# EAGLE schematic main (EAGLE 8.3.2)
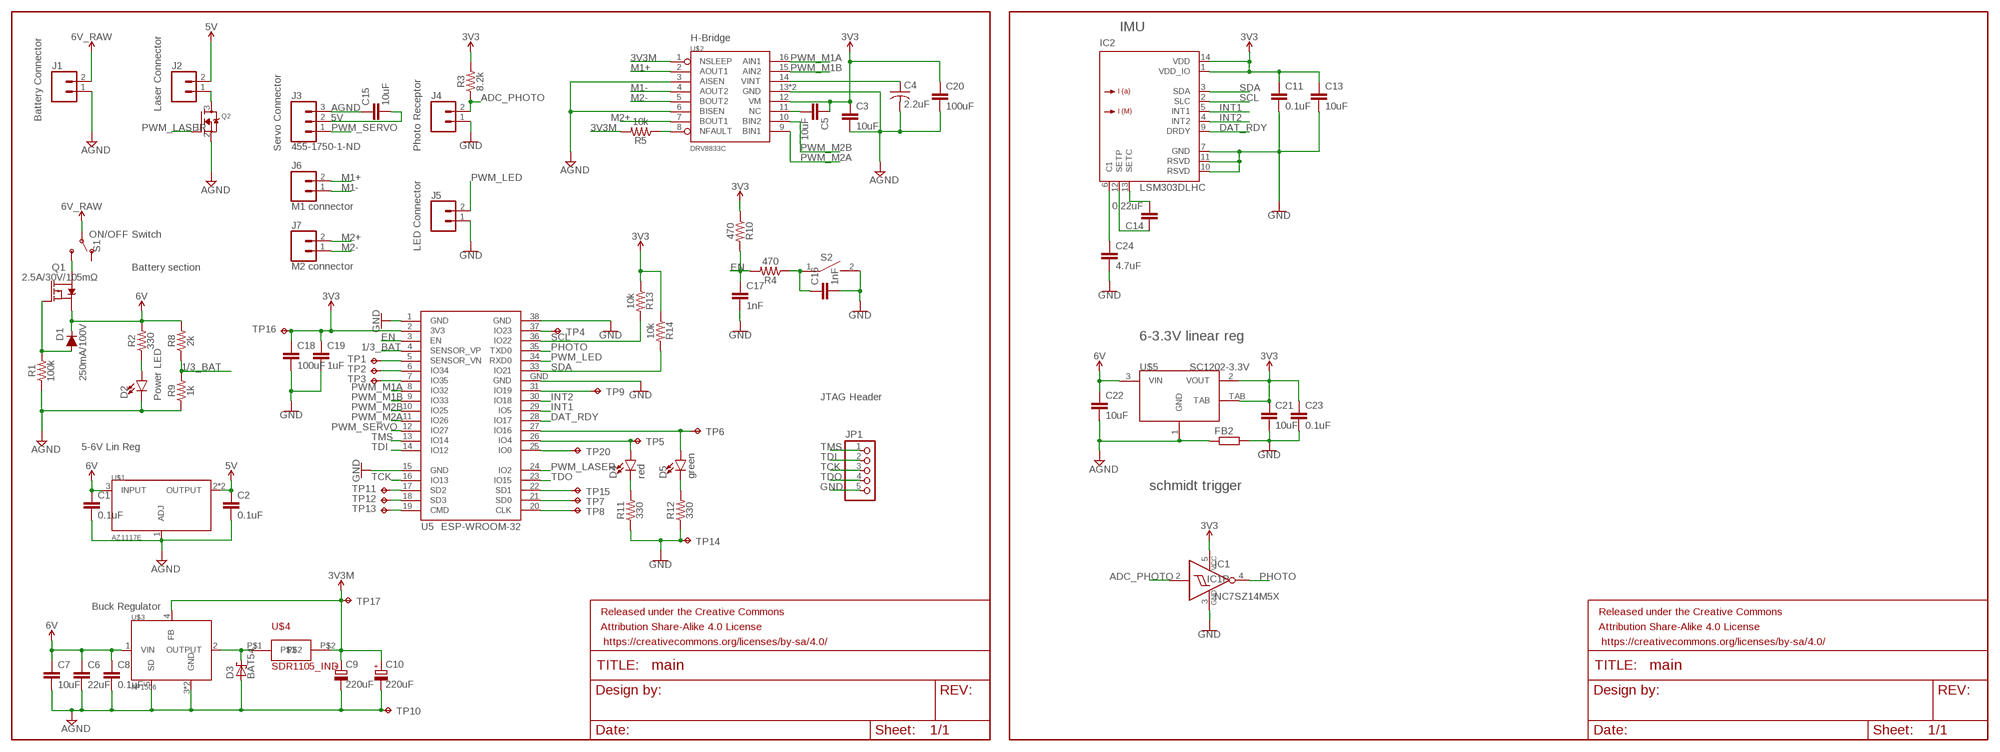
[diagram p0: schematic, sheet 1]

## Parts
C1  0.1uF  0.1UF-0603-25V-(+80/-20%)  [0603]
C2  0.1uF  0.1UF-0603-25V-(+80/-20%)  [0603]
C3  10uF  C-EUC0805  [C0805]
C4  2.2uF  C-USC0603  [C0603]
C5  10uF  C-EUC0805  [C0805]
C6  22uF  C-EUC0805  [C0805]
C7  10uF  C-EUC0805  [C0805]
C8  0.1uF  0.1UF-0603-25V-(+80/-20%)  [0603]
C9  220uF  CPOL-EUB/3528-21R  [B/3528-21R]
C10  220uF  CPOL-EUB/3528-21R  [B/3528-21R]
C11  0.1uF  0.1UF-0603-25V-(+80/-20%)  [0603]
C13  10uF  C-EUC0805  [C0805]
C14  0.22uF  0.1UF-0603-25V-(+80/-20%)  [0603]
C15  10uF  C-EUC0805  [C0805]
C16  1nF  0.1UF-0603-25V-(+80/-20%)  [0603]
C17  1nF  0.1UF-0603-25V-(+80/-20%)  [0603]
C18  100uF  CC1206  [C1206]
C19  1uF  0.1UF-0603-25V-(+80/-20%)  [0603]
C20  100uF  CC1206  [C1206]
C21  10uF  C-EUC0805  [C0805]
C22  10uF  C-EUC0805  [C0805]
C23  0.1uF  0.1UF-0603-25V-(+80/-20%)  [0603]
C24  4.7uF  0.1UF-0603-25V-(+80/-20%)  [0603]
D1  250mA/100V  DIODE-BAS16J  [SOD-323]
D2  LED0603  [LED-0603]
D3  BAT54  [SOT23]
D4  red  LED0603  [LED-0603]
D5  green  LED0603  [LED-0603]
FB2  R-EU_R0603  [R0603]
FRAME1  FRAME-LETTERNO_PACKAGE  [DUMMY]
FRAME2  FRAME-LETTERNO_PACKAGE  [DUMMY]
IC1  NC7SZ14M5X  [SOT23-5]
IC2  LSM303DLHC  [LGA-14]
J1  CONN_02  [1X02]
J2  CONN_02  [1X02]
J3  455-1750-1-ND  CONN_03  [1X03]
J4  CONN_02  [1X02]
J5  CONN_02  [1X02]
J6  M1 connector  CONN_02  [1X02]
J7  M2 connector  CONN_02  [1X02]
JP1  PINHD-1X5  [1X05]
Q1  2.5A/30V/105mΩ  MOSFET_PCH-DMG2307L  [SOT23-3]
Q2  MOSFET-NREFLOW  [SOT23]
R1  100k  RESISTOR0603  [0603]
R2  330  RESISTOR0603  [0603]
R3  8.2k  RESISTOR0603  [0603]
R4  470  RESISTOR0603  [0603]
R5  10k  RESISTOR0603  [0603]
R8  2k  RESISTOR0603  [0603]
R9  1k  RESISTOR0603  [0603]
R10  470  RESISTOR0603  [0603]
R11  330  RESISTOR0603  [0603]
R12  330  RESISTOR0603  [0603]
R13  10k  RESISTOR0603  [0603]
R14  10k  RESISTOR0603  [0603]
RESET1  S2  SWITCH  [SW_2512]
S1  SWITCH-SPDTRIGHTANGLESWITCH  [L102021ML04Q]
TP1  TPPAD1-13  [P1-13]
TP2  TPPAD1-13  [P1-13]
TP3  TPPAD1-13  [P1-13]
TP4  TPPAD1-13  [P1-13]
TP5  TPPAD1-13  [P1-13]
TP6  TPPAD1-13  [P1-13]
TP7  TPPAD1-13  [P1-13]
TP8  TPPAD1-13  [P1-13]
TP9  TPPAD1-13  [P1-13]
TP10  TPPAD1-13  [P1-13]
TP11  TPPAD1-13  [P1-13]
TP12  TPPAD1-13  [P1-13]
TP13  TPPAD1-13  [P1-13]
TP14  TPPAD1-13  [P1-13]
TP15  TPPAD1-13  [P1-13]
TP16  TPPAD1-13  [P1-13]
TP17  TPPAD1-13  [P1-13]
TP20  TPPAD1-13  [P1-13]
U5  ESP-WROOM-32  [ESP-WROOM-32]
U$1  AZ1117E  [SOT223]
U$2  DRV8833C  [HTSSOP-16]
U$3  AP1506  [TO263-5]
U$4  SDR1105_IND  [SDR1105]
U$5  SC1202-3.3V  [SOT-223]

## Nets
1/3_BAT: R8.1 R9.2 U5.4(SENSOR_VP)
3V3: C11.1 C13.1 C18.1 C19.1 C21.1 C23.1 IC1.5(VCC) IC2.1(VDD_IO) IC2.14(VDD) R3.2 R10.1 R13.1 R14.1 TP16.TP U5.2(3V3) U$5.2(VOUT) U$5.TAB
3V3M: C3.1 C5.1 C9.+ C10.+ C20.1 R5.2 TP17.TP U$2.1(NSLEEP) U$2.12(VM) U$3.4(FB) U$4.P$2 ; supply symbol labelled 3V3
5V: C2.1 C15.2 J2.2 J3.2 U$1.2(OUTPUT) U$1.4(OUTPUT)
6V: C1.1 C6.1 C7.1 C8.1 C22.1 D1.C Q1.2(S) R2.2 R8.2 U$1.3(INPUT) U$3.1(VIN) U$5.3(VIN)
6V_RAW: J1.2 S1.P$2(P)
ADC_PHOTO: IC1.2(I) J4.2 R3.1
AGND: C1.2 C2.2 C3.2 C4.2 C6.2 C7.2 C8.2 C9.- C10.- C15.1 C20.2 C22.2 D2.C D3.1(A) FB2.1 J1.1 J3.3 Q2.2(S) R1.1 R9.1 TP10.TP U$1.1(ADJ) U$2.3(AISEN) U$2.6(BISEN) U$2.13(GND) U$2.17(GND) U$3.3(GND) U$3.5(SD) U$3.6(GND) U$5.1(GND)
DAT_RDY: IC2.9(DRDY) U5.28(IO17)
EN: C17.1 R4.2 R10.2 U5.3(EN)
GND: C11.2 C13.2 C16.2 C17.2 C18.2 C19.2 C21.2 C23.2 C24.2 FB2.2 IC1.3(GND) IC2.7(GND) IC2.10(RSVD) IC2.11(RSVD) J4.1 J5.1 JP1.5 R11.1 R12.1 RESET1.2 TP14.TP U5.1(GND) U5.15(GND) U5.38(GND) U5.GND
INT1: IC2.5(INT1) U5.29(IO5)
INT2: IC2.4(INT2) U5.30(IO18)
M1+: J6.2 U$2.2(AOUT1)
M1-: J6.1 U$2.4(AOUT2)
M2+: J7.2 U$2.7(BOUT1)
M2-: J7.1 U$2.5(BOUT2)
N$1: D1.A Q1.1(G) R1.2
N$2: D2.A R2.1
N$3: Q1.3(D) S1.P$3(S)
N$4: TP1.TP U5.5(SENSOR_VN)
N$5: TP2.TP U5.6(IO34)
N$7: D3.3(C) U$3.2(OUTPUT) U$4.P$1
N$8: C4.1 U$2.14(VINT)
N$9: C5.2 U$2.11(NC)
N$10: J2.1 Q2.3(D)
N$11: C16.1 R4.1 RESET1.1
N$13: R5.1 U$2.8(NFAULT)
N$14: TP3.TP U5.7(IO35)
N$15: TP8.TP U5.20(CLK)
N$16: D4.A TP5.TP U5.26(IO4)
N$17: TP7.TP U5.21(SD0)
N$18: TP15.TP U5.22(SD1)
N$19: D5.A TP6.TP U5.27(IO16)
N$20: TP11.TP U5.17(SD2)
N$21: TP12.TP U5.18(SD3)
N$22: TP13.TP U5.19(CMD)
N$23: TP9.TP U5.31(IO19)
N$24: TP4.TP U5.37(IO23)
N$25: D4.C R11.2
N$26: D5.C R12.2
N$27: TP20.TP U5.25(IO0)
N$28: C14.2 IC2.13(SETC)
N$29: C14.1 IC2.12(SETP)
N$35: C24.1 IC2.6(C1)
PHOTO: IC1.4(O) U5.35(TXD0)
PWM_LASER: Q2.1(G) U5.24(IO2)
PWM_LED: J5.2 U5.34(RXD0)
PWM_M1A: U5.8(IO32) U$2.16(AIN1)
PWM_M1B: U5.9(IO33) U$2.15(AIN2)
PWM_M2A: U5.11(IO26) U$2.9(BIN1)
PWM_M2B: U5.10(IO25) U$2.10(BIN2)
PWM_SERVO: J3.1 U5.12(IO27)
SCL: IC2.2(SLC) R13.2 U5.36(IO22)
SDA: IC2.3(SDA) R14.2 U5.33(IO21)
TCK: JP1.3 U5.16(IO13)
TDI: JP1.2 U5.14(IO12)
TDO: JP1.4 U5.23(IO15)
TMS: JP1.1 U5.13(IO14)
Unconnected: S1.P$1(O)

## Notes on the sheet
- IMU
- S2
- Battery section
- 6-3.3V linear reg
- JTAG Header
- schmidt trigger

## Library data of the parts
C1 C2 C8 C11 C23 = electricSheepParty:0.1UF: 0.1µF ceramic capacitors A capacitor is a passive two-terminal electrical component used to store electrical energy temporarily in an electric field.; PROD_ID: CAP-00810
C3 C5-C7 C13 C15 C21 C22 = rcl:C-EU: CAPACITOR, European symbol
C4 = rcl:C-US: CAPACITOR, American symbol
C9 C10 = rcl:CPOL-EU: POLARIZED CAPACITOR, European symbol
C14 C16 C17 C19 C24 = electricSheepParty:0.1UF: 0.1µF ceramic capacitors A capacitor is a passive two-terminal electrical component used to store electrical energy temporarily in an electric field.; PROD_ID: CAP-00810; VALUE: 0.1uF
C18 C20 = eagle-ltspice:C: CAPACITOR, European symbol; SPICEMODEL: NONE; SPICEPREFIX: C
D1 = electricSheepParty:DIODE: Diode These are standard reverse protection diodes and small signal diodes. SparkFun Products: SparkFun SparkPunk Sound Kit <https://www.sparkfun.com/products/11177> SparkFun ESP8266 Thing <https://www.sparkfun.com/products/13231>; PROD_ID: DIO-09646
D2 D4 D5 = electricSheepParty:LED: LED (Generic) Standard schematic elements and footprints for 5mm, 3mm, 1206, and 0603 sized LEDs. Generic LEDs with no color specified.; COMMENT: Power LED
D3 = diode:BAT54: Schottky Diodes Source: Fairchild .. BAT54.pdf
FB2 = rcl:R-EU_: RESISTOR, European symbol
FRAME1 FRAME2 = SparkFun-Aesthetics:FRAME-LETTER: Schematic Frame - Letter Standard 8.5x11 US Letter frame; DESIGNER: Nobody; VERSION: v01
IC1 = electricSheepParty:NC7SZ14: TinyLogic(R) UHS Inverter with Schmitt Trigger Input Source: http://www.fairchildsemi.com/ds/NC/NC7SZ14.pdf
IC2 = st-microelectronics:LSM303DLHC: Ultra compact high performance e-compass, 3D accelerometer and 3D magnetometer module Source: DM00027543-118326.pdf
J1 J6 J7 = electricSheepParty:CONN_02: Multi connection point. Often used as Generic Header-pin footprint for 0.1 inch spaced/style header connections On any of the 0.1 inch spaced packages, you can populate with these: Break Away Headers - Straight <https://www.sparkfun.com/products/116> (PRT-00116) Break Away Male Headers - Right Angle <https://www.sparkfun.com/products/553> (PRT-00553) Female Headers <https://www.sparkfun.com/products/115> (PRT-00115) Break Away Headers - Machine Pin <https://www.sparkfun.com/products/117> (PRT-00117) Break Away Female Headers - Swiss Machine Pin <https://www.sparkfun.com/products/743> (PRT-00743) For SCREWTERMINALS and SPRING TERMINALS visit here: Screw Terimnals on SparkFun.com <https://www.sparkfun.com/search/results?term=Screw+Terminals> (5mm/3.5mm/2.54mm spacing) This device is also useful as a general connection point to wire up your design to another part of your project. Our various solder wires solder well into these plated through hole pads. Hook-Up Wire - Assortment (Stranded, 22 AWG) <https://www.sparkfun.com/products/11375> (PRT-11375) Hook-Up Wire - Assortment (Solid Core, 22 AWG) <https://www.sparkfun.com/products/11367> (PRT-11367) View the entire wire category on our website here <https://www.sparkfun.com/categories/141> Special notes: Molex polarized connector foot print use with: PRT-08233 with associated crimp pins and housings. 2.54_SCREWTERM for use with PRT-10571. 3.5mm Screw Terminal footprints for PRT-08084 5mm Screw Terminal footprints for use with PRT-08432; COMM: Battery Connector
J2 = electricSheepParty:CONN_02: Multi connection point. Often used as Generic Header-pin footprint for 0.1 inch spaced/style header connections On any of the 0.1 inch spaced packages, you can populate with these: Break Away Headers - Straight <https://www.sparkfun.com/products/116> (PRT-00116) Break Away Male Headers - Right Angle <https://www.sparkfun.com/products/553> (PRT-00553) Female Headers <https://www.sparkfun.com/products/115> (PRT-00115) Break Away Headers - Machine Pin <https://www.sparkfun.com/products/117> (PRT-00117) Break Away Female Headers - Swiss Machine Pin <https://www.sparkfun.com/products/743> (PRT-00743) For SCREWTERMINALS and SPRING TERMINALS visit here: Screw Terimnals on SparkFun.com <https://www.sparkfun.com/search/results?term=Screw+Terminals> (5mm/3.5mm/2.54mm spacing) This device is also useful as a general connection point to wire up your design to another part of your project. Our various solder wires solder well into these plated through hole pads. Hook-Up Wire - Assortment (Stranded, 22 AWG) <https://www.sparkfun.com/products/11375> (PRT-11375) Hook-Up Wire - Assortment (Solid Core, 22 AWG) <https://www.sparkfun.com/products/11367> (PRT-11367) View the entire wire category on our website here <https://www.sparkfun.com/categories/141> Special notes: Molex polarized connector foot print use with: PRT-08233 with associated crimp pins and housings. 2.54_SCREWTERM for use with PRT-10571. 3.5mm Screw Terminal footprints for PRT-08084 5mm Screw Terminal footprints for use with PRT-08432; COMM: Laser Connector
J3 = electricSheepParty:CONN_03: Multi connection point. Often used as Generic Header-pin footprint for 0.1 inch spaced/style header connections On any of the 0.1 inch spaced packages, you can populate with these: Break Away Headers - Straight <https://www.sparkfun.com/products/116> (PRT-00116) Break Away Male Headers - Right Angle <https://www.sparkfun.com/products/553> (PRT-00553) Female Headers <https://www.sparkfun.com/products/115> (PRT-00115) Break Away Headers - Machine Pin <https://www.sparkfun.com/products/117> (PRT-00117) Break Away Female Headers - Swiss Machine Pin <https://www.sparkfun.com/products/743> (PRT-00743) Stackable Header - 3 Pin (Female, 0.1") <https://www.sparkfun.com/products/13875> (PRT-13875) For SCREWTERMINALS and SPRING TERMINALS visit here: Screw Terimnals on SparkFun.com <https://www.sparkfun.com/search/results?term=Screw+Terminals> (5mm/3.5mm/2.54mm spacing) This device is also useful as a general connection point to wire up your design to another part of your project. Our various solder wires solder well into these plated through hole pads. Hook-Up Wire - Assortment (Stranded, 22 AWG) <https://www.sparkfun.com/products/11375> (PRT-11375) Hook-Up Wire - Assortment (Solid Core, 22 AWG) <https://www.sparkfun.com/products/11367> (PRT-11367) View the entire wire category on our website here <https://www.sparkfun.com/categories/141> Special notes: Molex polarized connector foot print use with SKU : PRT-08232 with associated crimp pins and housings.; COMM: Servo Connector; PROD_ID: XXX-00000
J4 = electricSheepParty:CONN_02: Multi connection point. Often used as Generic Header-pin footprint for 0.1 inch spaced/style header connections On any of the 0.1 inch spaced packages, you can populate with these: Break Away Headers - Straight <https://www.sparkfun.com/products/116> (PRT-00116) Break Away Male Headers - Right Angle <https://www.sparkfun.com/products/553> (PRT-00553) Female Headers <https://www.sparkfun.com/products/115> (PRT-00115) Break Away Headers - Machine Pin <https://www.sparkfun.com/products/117> (PRT-00117) Break Away Female Headers - Swiss Machine Pin <https://www.sparkfun.com/products/743> (PRT-00743) For SCREWTERMINALS and SPRING TERMINALS visit here: Screw Terimnals on SparkFun.com <https://www.sparkfun.com/search/results?term=Screw+Terminals> (5mm/3.5mm/2.54mm spacing) This device is also useful as a general connection point to wire up your design to another part of your project. Our various solder wires solder well into these plated through hole pads. Hook-Up Wire - Assortment (Stranded, 22 AWG) <https://www.sparkfun.com/products/11375> (PRT-11375) Hook-Up Wire - Assortment (Solid Core, 22 AWG) <https://www.sparkfun.com/products/11367> (PRT-11367) View the entire wire category on our website here <https://www.sparkfun.com/categories/141> Special notes: Molex polarized connector foot print use with: PRT-08233 with associated crimp pins and housings. 2.54_SCREWTERM for use with PRT-10571. 3.5mm Screw Terminal footprints for PRT-08084 5mm Screw Terminal footprints for use with PRT-08432; COMM: Photo Receptor
J5 = electricSheepParty:CONN_02: Multi connection point. Often used as Generic Header-pin footprint for 0.1 inch spaced/style header connections On any of the 0.1 inch spaced packages, you can populate with these: Break Away Headers - Straight <https://www.sparkfun.com/products/116> (PRT-00116) Break Away Male Headers - Right Angle <https://www.sparkfun.com/products/553> (PRT-00553) Female Headers <https://www.sparkfun.com/products/115> (PRT-00115) Break Away Headers - Machine Pin <https://www.sparkfun.com/products/117> (PRT-00117) Break Away Female Headers - Swiss Machine Pin <https://www.sparkfun.com/products/743> (PRT-00743) For SCREWTERMINALS and SPRING TERMINALS visit here: Screw Terimnals on SparkFun.com <https://www.sparkfun.com/search/results?term=Screw+Terminals> (5mm/3.5mm/2.54mm spacing) This device is also useful as a general connection point to wire up your design to another part of your project. Our various solder wires solder well into these plated through hole pads. Hook-Up Wire - Assortment (Stranded, 22 AWG) <https://www.sparkfun.com/products/11375> (PRT-11375) Hook-Up Wire - Assortment (Solid Core, 22 AWG) <https://www.sparkfun.com/products/11367> (PRT-11367) View the entire wire category on our website here <https://www.sparkfun.com/categories/141> Special notes: Molex polarized connector foot print use with: PRT-08233 with associated crimp pins and housings. 2.54_SCREWTERM for use with PRT-10571. 3.5mm Screw Terminal footprints for PRT-08084 5mm Screw Terminal footprints for use with PRT-08432; COMM: LED Connector
JP1 = pinhead:PINHD-1X5: PIN HEADER
Q1 = electricSheepParty:MOSFET_PCH: P-channel MOSFETs Voltage controlled devices that allow control of high current outputs. SparkFun Products: SparkFun ESP32 Thing <https://www.sparkfun.com/products/13907> SparkFun ESP8266 Thing <https://www.sparkfun.com/products/13231>; PROD_ID: TRANS-11308
Q2 = adafruit:MOSFET-N: N-Channel Mosfet 2N7002E - 60V 260mA SOT23 [Digikey: 2N7002ET1GOSTR-ND] - REEL BSH103 - 30V 850mA SOT23 [Digikey: 568-5013-1-ND]
R1-R5 R8-R14 = electricSheepParty:RESISTOR: Generic Resistor Package
RESET1 = DiscreteComponents:SWITCH
S1 = electricSheepParty:SWITCH-SPDT: Single Pole, Double Throw (SPDT) Switch Single-pole, double-throw (SPDT) switch. Variant Overview SMD-AYZ0202 Surface Mount DPDT Switch <https://www.sparkfun.com/products/597> (COM-00597) Used on e.g. LilyPad Arduino USB - ATmega32U4 Board <https://www.sparkfun.com/products/12049> PTH-11.6X4.0MM SPDT Mini Power Switch <https://www.sparkfun.com/products/102> (COM-00102) Used on e.g. SparkFun Simon Says - Through-Hole Soldering Kit <https://www.sparkfun.com/products/10547> (KIT-10547) PTH-11.6X4.0MM-KIT KIT version of SPDT Mini Power Switch - Simplifies soldering by removing tStop of switch pins - only one side can be soldered. PTH-11.6X4.0MM-LOCK LOCK version of SPDT Mini Power Switch - Offset pins hold switch in place for easier soldering. SMD-RIGHT-ANGLE Surface Mount Right Angle Switch <https://www.sparkfun.com/products/10860> (COM-10860) Used on e.g. SparkFun ESP8266 Thing <https://www.sparkfun.com/products/13231>; COMM: ON/OFF Switch
TP1-TP17 TP20 = testpad:TP: Test pad
U5 = electricSheepParty:ESP-WROOM-32: Espressif Systems ESP-WROOM-32
U$1 = electricSheepParty:AZ1117E; COMM: 5-6V Lin Reg
U$2 = electricSheepParty:DRV8833C; COMM: H-Bridge
U$3 = electricSheepParty:AP1506; COMM: Buck Regulator
U$4 = sheep:SDR1105_IND
U$5 = carolyn:SC1202-3.3V